# EAGLE design oscboard (EAGLE 7.5.0)
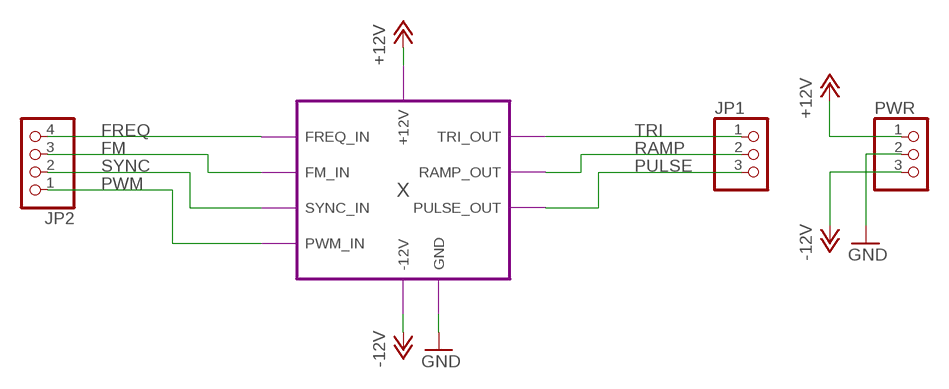
[diagram p0: schematic, sheet 1]

## Parts
JP1  PINHD-1X3  [1X03]
JP2  PINHD-1X4  [1X04]
PWR  PINHD-1X3  [1X03]

## Module instances
X = VCO

## Nets
+12V: PWR.1 ; port X.+12V
-12V: PWR.3 ; port X.-12V
FM: JP2.3 ; port X.FM_IN
FREQ: JP2.4 ; port X.FREQ_IN
GND: PWR.2 ; port X.GND
PULSE: JP1.3 ; port X.PULSE_OUT
PWM: JP2.1 ; port X.PWM_IN
RAMP: JP1.2 ; port X.RAMP_OUT
SYNC: JP2.2 ; port X.SYNC_IN
TRI: JP1.1 ; port X.TRI_OUT

## Library data of the parts
JP1 PWR = pinhead:PINHD-1X3: PIN HEADER
JP2 = pinhead:PINHD-1X4: PIN HEADER

## Module VCO
Ports: FREQ_IN(io) FM_IN(io) SYNC_IN(io) PWM_IN(io) TRI_OUT(io) RAMP_OUT(io) PULSE_OUT(io) -12V(pwr) +12V(pwr) GND(pwr)
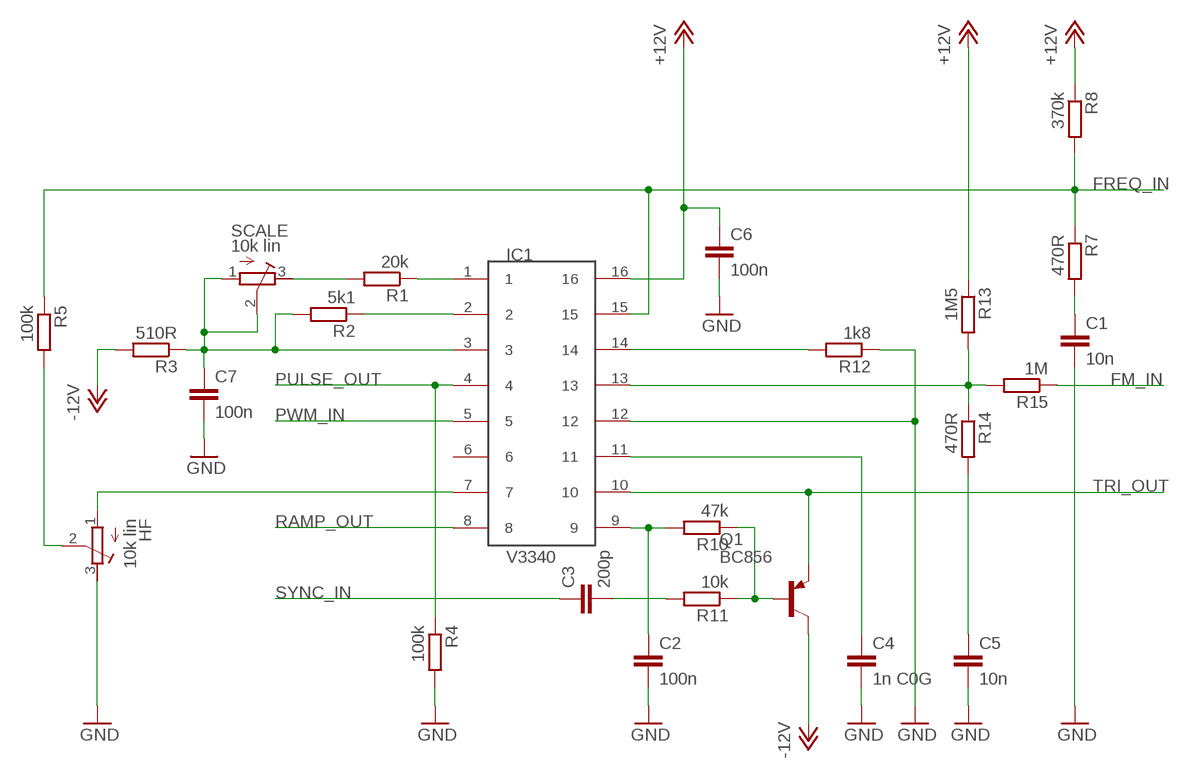
[diagram p1: schematic, module VCO, sheet 1]

### Parts
C1  10n  C-EUC0603  [C0603]
C2  100n  C-EUC0603  [C0603]
C3  200p  C-EUC0603  [C0603]
C4  1n C0G  C-EUC0603  [C0603]
C5  10n  C-EUC0603  [C0603]
C6  100n  C-EUC0603  [C0603]
C7  100n  C-EUC0603  [C0603]
HF  10k lin  R-TRIMM64W  [RTRIM64W]
IC1  V3340  CEM3340  [SOIC16N]
Q1  BC856  BC856A-PNP-SOT23-BEC  [SOT23-BEC]
R1  20k  R-EU_0603  [0603]
R2  5k1  R-EU_0603  [0603]
R3  510R  R-EU_0603  [0603]
R4  100k  R-EU_0603  [0603]
R5  100k  R-EU_0603  [0603]
R7  470R  R-EU_0603  [0603]
R8  370k  R-EU_0603  [0603]
R10  47k  R-EU_0603  [0603]
R11  10k  R-EU_0603  [0603]
R12  1k8  R-EU_0603  [0603]
R13  1M5  R-EU_0603  [0603]
R14  470R  R-EU_0603  [0603]
R15  1M  R-EU_0603  [0603]
SCALE  10k lin  R-TRIMM64W  [RTRIM64W]

### Nets
+12V: C6.1 IC1.16 R8.1 R13.1
-12V: Q1.C R3.2
FM_IN: R15.1
FREQ_IN: IC1.15 R5.1 R7.1 R8.2
GND: C1.2 C2.2 C4.2 C5.2 C6.2 C7.2 HF.3(E) IC1.12 R4.2 R12.1
N$1: IC1.1 R1.1
N$2: R1.2 SCALE.3(E)
N$3: HF.1(A) IC1.7
N$4: IC1.2 R2.1
N$5: C7.1 IC1.3 R2.2 R3.1 SCALE.1(A) SCALE.2(S)
N$6: HF.2(S) R5.2
N$9: C1.1 R7.2
N$11: C2.1 IC1.9 R10.2
N$12: Q1.B R10.1 R11.1
N$13: C3.2 R11.2
N$14: C4.1 IC1.11
N$16: IC1.14 R12.2
N$17: IC1.13 R13.2 R14.1 R15.2
N$18: C5.1 R14.2
PULSE_OUT: IC1.4 R4.1
PWM_IN: IC1.5
RAMP_OUT: IC1.8
SYNC_IN: C3.1
TRI_OUT: IC1.10 Q1.E
Unconnected: IC1.6

### Library data of the parts
C1-C7 = Rebel:C-EU: CAPACITOR, European symbol
HF SCALE = resistor:R-TRIMM: Trimm resistor
IC1 = Rebel:CEM3340: CEM3340 VCO
Q1 = transistor:*-PNP-: PNP Transistror
R1-R5 R7 R8 R10-R15 = Rebel:R-EU_: RESISTOR, European symbol

## Board
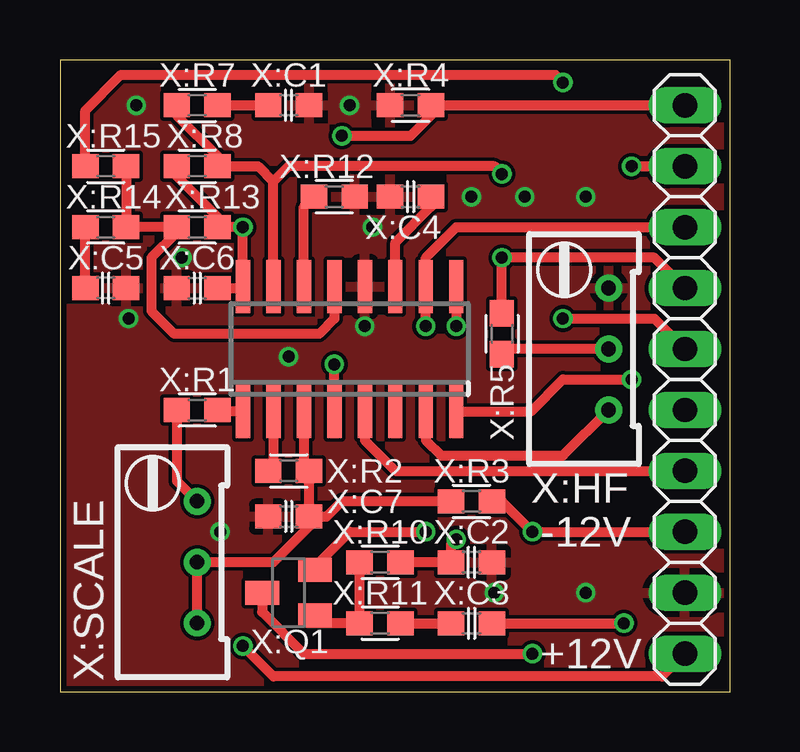
[diagram p2: board, top side]
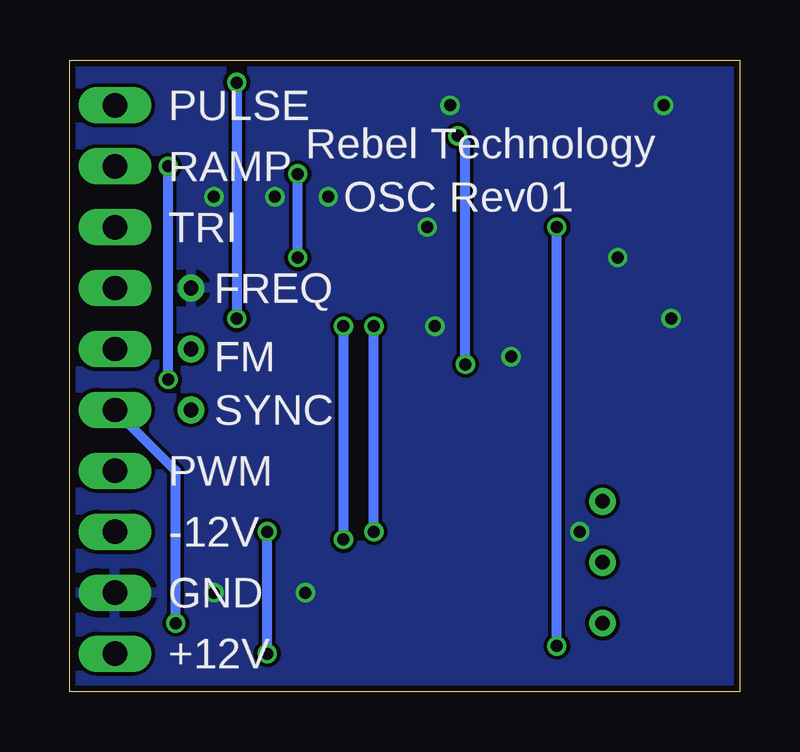
[diagram p3: board, bottom side, seen from below]

Size 27.92 x 26.34 mm. Coordinates in mm from the lower left corner, seen from the top.
Outline: 0,0 27.92,0 27.92,26.34 0,26.34 0,0
Copper layers (1*16): Top 0.035mm / dielectric 1.5mm / Bottom 0.035mm
Design rules "SeeedStudio_2layer_DRU_no_angle_20140221": minimum track width 6mil, minimum drill 12mil, track to track 6mil, track to pad 6mil, pad to pad 6mil, via to via 6mil, smd to smd 0mil, copper to edge 10mil, drill to drill 10mil, minimum pad ring 10mil, minimum via ring 6mil, stop-mask expansion 2mil, vias tented up to drill 100mil, thermal gap 10mil

### Footprints (pad centres in the part's own frame; a part is rotated, then mirrored left to right if it is on the bottom)
1X03 = drill 1.016 long: 1 -2.54,0; 2 0,0; 3 2.54,0
1X04 = drill 1.016 long: 1 -3.81,0; 2 -1.27,0; 3 1.27,0; 4 3.81,0
C0603 = smd 1.1 x 1: 1 -0.85,0; 2 0.85,0
RTRIM64W = drill 0.61: 1 1.27,-2.54; 2 1.27,0; 3 1.27,2.54
SOIC16N = smd 0.6 x 2.2: 1 -4.445,-2.6; 2 -3.175,-2.6; 3 -1.905,-2.6; 4 -0.635,-2.6; 5 0.635,-2.6; 6 1.905,-2.6; 7 3.175,-2.6; 8 4.445,-2.6; 9 4.445,2.6; 10 3.175,2.6; 11 1.905,2.6; 12 0.635,2.6; 13 -0.635,2.6; 14 -1.905,2.6; 15 -3.175,2.6; 16 -4.445,2.6
SOT23-BEC = smd 1 x 1.4: B -0.95,-1.1; C 0,1.1; E 0.95,-1.1
0603 = smd 1.1 x 1: 1 -0.85,0; 2 0.85,0

### Placement (x,y rotation side)
JP1  26.04,21.91 90 top
JP2  26.04,13.02 90 top
PWR  26.04,4.13 90 top
X:C1  10n  [C0603]  9.53,24.45 0 top
X:C2  100n  [C0603]  17.15,5.4 0 top
X:C3  200p  [C0603]  17.15,2.86 180 top
X:C4  1n C0G  [C0603]  14.61,20.64 180 top
X:C5  10n  [C0603]  1.91,16.83 0 top
X:C6  100n  [C0603]  5.71,16.83 180 top
X:C7  100n  [C0603]  9.53,7.3 180 top
X:HF  10k lin  [RTRIM64W]  21.59,14.29 0 top
X:IC1  V3340  [SOIC16N]  12.06,14.29 0 top
X:Q1  BC856  [SOT23-BEC]  9.53,4.13 90 top
X:R1  20k  [0603]  5.71,11.75 180 top
X:R2  5k1  [0603]  9.53,9.21 0 top
X:R3  510R  [0603]  17.15,7.94 0 top
X:R4  100k  [0603]  14.61,24.45 180 top
X:R5  100k  [0603]  18.42,14.92 270 top
X:R7  470R  [0603]  5.71,24.45 0 top
X:R8  370k  [0603]  5.71,21.91 0 top
X:R10  47k  [0603]  13.33,5.4 0 top
X:R11  10k  [0603]  13.33,2.86 0 top
X:R12  1k8  [0603]  11.43,20.64 180 top
X:R13  1M5  [0603]  5.71,19.37 180 top
X:R14  470R  [0603]  1.91,19.37 180 top
X:R15  1M  [0603]  1.91,21.91 0 top
X:SCALE  10k lin  [RTRIM64W]  4.45,5.4 0 top

### Tracks (layer width: path | path; a pad name or v marks a point on that pad's centre or on a via)
+12V  (via drill 0.5)
  Top 0.406: X:R8.1 4.87,21.49 6.56,19.79 X:R13.1 v7.62,19.37 X:IC1.16 7.56,16.83 X:C6.1 | PWR.1 25.08,0.64 8.89,0.64 v7.62,1.9
  Bottom 0.406: v7.62,1.9 v7.62,19.37
-12V  (via drill 0.5)
  Top 0.406: PWR.3 v19.69,6.67 18.42,7.94 X:R3.2 | X:Q1.C 8.43,3.32 10.16,1.59 v19.69,1.59
  Bottom 0.406: v19.69,1.59 v19.69,6.67
FM  (via drill 0.5)
  Top 0.406: X:R15.1 1.05,24.23 2.54,25.72 20.64,25.72 v20.96,25.4 | v20.96,15.56 24.77,15.56 JP2.3
  Bottom 0.406: v20.96,25.4 v20.96,15.56
FREQ  (via drill 0.5)
  Top 0.406: X:R5.1 v18.42,18.1 24.77,18.1 JP2.4 | v18.42,21.59 18.1,21.91 9.53,21.91 8.89,21.27 | X:IC1.15 8.89,21.27 | 8.89,21.27 8.26,21.91 X:R8.2 6.56,22.33 4.87,24.03 X:R7.1
  Bottom 0.406: v18.42,18.1 v18.42,21.59
GND  (via drill 0.5)
  other vias: 5.08,18.1 12.7,15.24 17.15,20.64 12.06,24.45 6.67,6.67 18.1,4.13 21.91,4.13 21.91,20.64 9.53,13.97 2.86,15.56 19.37,20.64 13.02,19.37 3.17,24.45
  pour Bottom: -0.32,26.99 -0.32,0 28.58,0 28.58,26.99
  pour Top: -0.32,26.99 -0.32,0 28.58,0 28.58,26.99
PULSE  (via drill 0.5)
  Top 0.406: X:IC1.4 v11.43,13.65 | v11.75,23.18 14.61,23.18 15.46,24.03 X:R4.1 JP1.3
  Bottom 0.406: v11.43,13.65 11.43,22.86 v11.75,23.18
PWM
  Top 0.406: X:IC1.5 12.7,10.48 13.97,9.21 JP2.1
RAMP  (via drill 0.5)
  Top 0.406: X:IC1.8 19.62,11.69 20.96,13.02 v23.81,13.02 | v23.81,21.91 JP1.2
  Bottom 0.406: v23.81,13.02 v23.81,21.91
SYNC  (via drill 0.5)
  Top 0.406: X:C3.1 v23.5,2.86
  Bottom 0.406: v23.5,2.86 23.5,9.21 JP2.2
TRI  (via drill 0.5)
  Top 0.406: JP1.1 16.51,19.37 15.24,18.1 X:IC1.10 v15.24,15.24 | X:Q1.E 10.62,5.23 12.06,6.67 v15.24,6.67
  Bottom 0.406: v15.24,6.67 v15.24,15.24
X:N$1
  Top 0.406: X:IC1.1 6.62,11.69 X:R1.1
X:N$2
  Top 0.406: X:R1.2 4.87,8.79 X:SCALE.3
X:N$3
  Top 0.406: X:HF.1 20.96,9.84 15.88,9.84 15.24,10.48 X:IC1.7
X:N$4
  Top 0.406: X:IC1.2 8.89,9.42 X:R2.1
X:N$5
  Top 0.406: X:IC1.3 10.16,9.42 X:R2.2 X:C7.1 | X:R3.1 11.75,7.94 11.11,7.3 X:C7.1 | X:C7.1 10.38,6.88 8.89,5.4 X:SCALE.2 X:SCALE.1
X:N$6
  Top 0.406: X:HF.2 18.84,14.29 X:R5.2
X:N$9
  Top 0.406: X:R7.2 X:C1.1
X:N$11  (via drill 0.5)
  Top 0.406: X:IC1.9 v16.51,15.24 | X:R10.2 X:C2.1 16.3,6.13 v16.51,6.35
  Bottom 0.406: v16.51,15.24 v16.51,6.35
X:N$12
  Top 0.406: X:Q1.B 10.31,2.86 X:R11.1 X:R10.1
X:N$13
  Top 0.406: X:R11.2 X:C3.2
X:N$14
  Top 0.406: X:IC1.11 13.97,18.73 15.46,20.22 X:C4.1
X:N$16
  Top 0.406: X:IC1.14 10.16,20.22 X:R12.2
X:N$17
  Top 0.406: X:IC1.13 11.43,15.56 10.79,14.92 4.76,14.92 3.81,15.87 3.81,18.1 4.87,19.15 X:R13.2 X:R14.1 X:R15.2
X:N$18
  Top 0.406: X:C5.1 X:R14.2

### Text on the board
tPlace: -12V | +12V
bPlace: Rebel Technology | PULSE | OSC Rev01 | RAMP | TRI | FREQ | FM | SYNC | PWM | -12V | GND | +12V